# EAGLE design mediatek_basic_v10 (EAGLE 5.09)
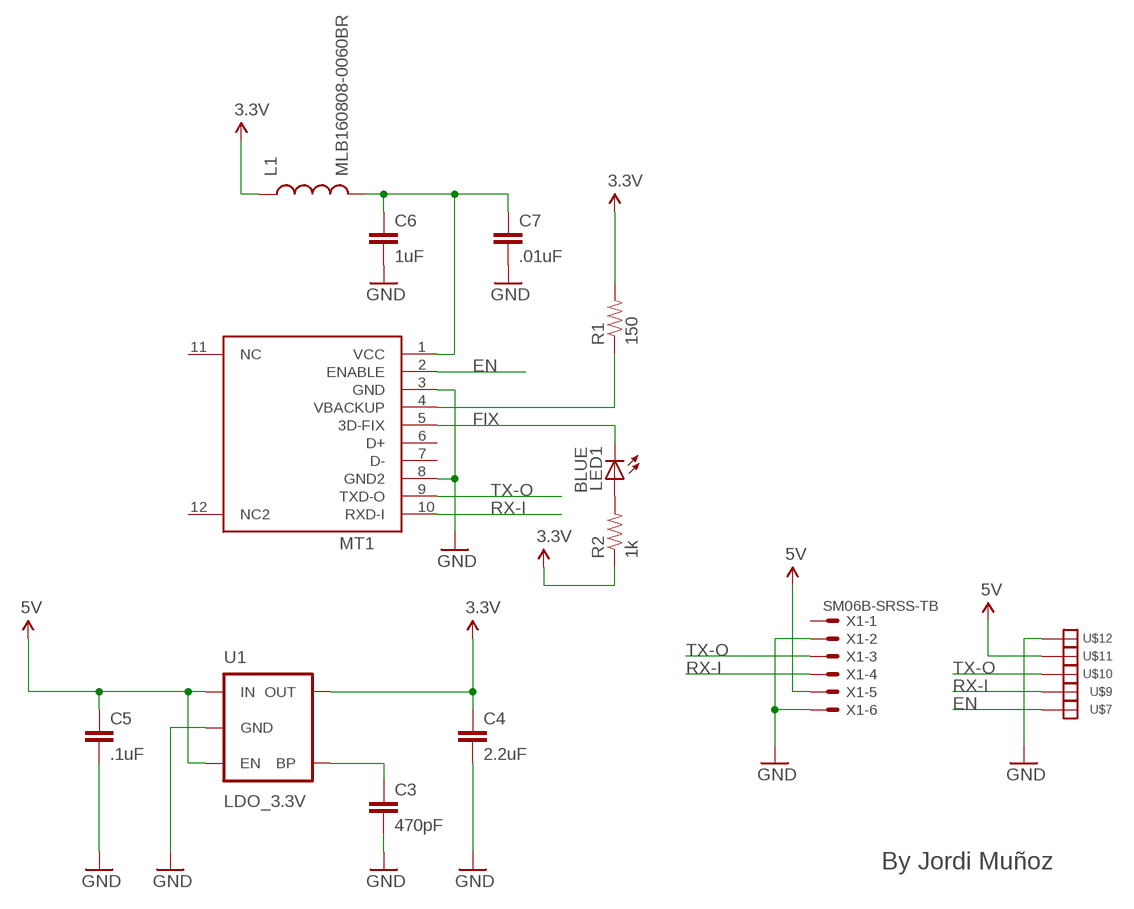
[diagram p0: schematic, sheet 1]

## Parts
C3  470pF  CAP0402  [C0402]
C4  2.2uF  CAP0402  [C0402]
C5  .1uF  CAP0402  [C0402]
C6  1uF  CAP0402  [C0402]
C7  .01uF  CAP0402  [C0402]
L1  MLB160808-0060BR  INDUCTOR0402  [C0402]
LED1  BLUE  LED0603  [LED-0603]
MT1  MEDIATEK_MT3329_PADS  [MEDIATEK_MT3329]
R1  150  RESISTOR0402  [C0402]
R2  1k  RESISTOR0402  [C0402]
U1  LDO_3.3V  V_REG_LDOSMD  [SOT23-5]
U$7  SOLDER_PAD150_75  [SOLD_PAD_150_75]
U$9  SOLDER_PAD150_75  [SOLD_PAD_150_75]
U$10  SOLDER_PAD150_75  [SOLD_PAD_150_75]
U$11  SOLDER_PAD150_75  [SOLD_PAD_150_75]
U$12  SOLDER_PAD150_75  [SOLD_PAD_150_75]
X1  SM06B-SRSS-TB  [SM06B-SRSS-TB]

## Nets
3.3V: C4.1 L1.1 R1.2 R2.1 U1.5(OUT)
5V: C5.1 U1.1(IN) U1.3(EN) U$11.P$1 X1.5
EN: MT1.2(ENABLE) U$7.P$1
FIX: LED1.C MT1.5(3D-FIX)
GND: C3.2 C4.2 C5.2 C6.2 C7.2 MT1.3(GND) MT1.8(GND2) U1.2(GND) U$12.P$1 X1.2 X1.6
N$2: MT1.4(VBACKUP) R1.1
N$4: C6.1 C7.1 L1.2 MT1.1(VCC)
N$5: C3.1 U1.4(BP)
N$6: LED1.A R2.2
RX-I: MT1.10(RXD-I) U$9.P$1 X1.4
TX-O: MT1.9(TXD-O) U$10.P$1 X1.3
Unconnected: MT1.6(D+) MT1.7(D-) MT1.11(NC) MT1.12(NC2) X1.1

## Notes on the sheet
- By Jordi Muñoz

## Library data of the parts
C3-C7 = DIYdrones3:CAP: Capacitor Standard 0603 ceramic capacitor, and 0.1" leaded capacitor.
L1 = SparkFun:INDUCTOR: Inductors Basic Inductor/Choke - 0603 and 1206. Footprints are not proven and vary greatly between part numbers.
LED1 = SparkFun:LED: LEDs Standard schematic elements and footprints for 5mm, 3mm, 1206, and 0603 sized LEDs. 5mm - Spark Fun Electronics SKU : COM-00529 (and others)
MT1 = DIYdrones_042910:MEDIATEK_MT3329_PADS: Based on MediaTek Single Chip Architecture. Dimension?16mm x 16mm x 6mm. L1 Frequency, C/A code, 66 channels. High Sensitivity?Up to -165dBm tracking, superior urban performances.
R1 R2 = DIYdrones3:RESISTOR: Resistor Basic schematic elements and footprints for 0603, 1206, and PTH 1/10th watt (small) resistors.
U1 = DIYdrones3:V_REG_LDO: Voltage Regulator LDO Standard 150mA LDO voltage regulator in SOT-23 layout. Micrel part MIC5205. BP (by-pass) pin is used to lower output noise with 470pF cap.
U$7 U$9-U$12 = DIYdrones2:SOLDER_PAD
X1 = con-jst2:?M06B-SRSS-TB: Disconnectable Crimp style connector, 1.0mm pitch 6 contacts

## Board
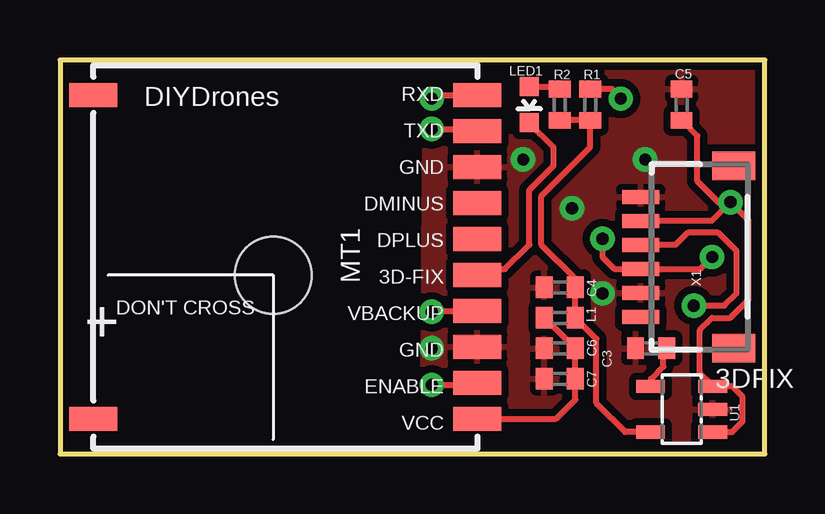
[diagram p1: board, top side]
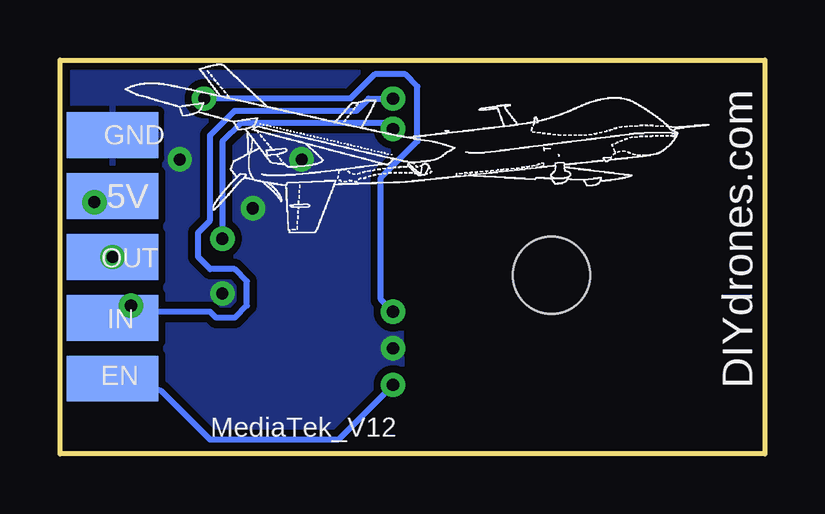
[diagram p2: board, bottom side, seen from below]

Size 29.37 x 16.43 mm. Coordinates in mm from the lower left corner, seen from the top.
Outline: 0,0 29.37,0 29.37,16.43 0,16.43 0,0
Copper layers (1*16): Top 0.035mm / dielectric 1.5mm / Bottom 0.035mm
Design rules "SparkFun": minimum track width 8mil, minimum drill 20mil, track to track 8mil, track to pad 8mil, pad to pad 8mil, via to via 8mil, smd to smd 8mil, copper to edge 10mil, drill to drill 8mil, minimum pad ring 12mil, minimum via ring 10mil, stop-mask expansion 4mil, vias tented up to drill 25mil, thermal gap 10mil
Holes 3.2 mm at 8.88,7.46

### Footprints (pad centres in the part's own frame; a part is rotated, then mirrored left to right if it is on the bottom)
C0402 = smd 0.7 x 0.9: 1 -0.65,0; 2 0.65,0
LED-0603 = smd 0.8 x 0.8: A 0,-0.75; C 0,0.75
MEDIATEK_MT3329 = smd 2 x 1: 1 -8,6.75; 2 -8,5.25; 3 -8,3.75; 4 -8,2.25; 5 -8,0.75; 6 -8,-0.75; 7 -8,-2.25; 8 -8,-3.75; 9 -8,-5.25; 10 -8,-6.75; 11 8,6.75; 12 8,-6.75
SOT23-5 = smd 0.55 x 1.2: 1 -0.95,-1.3; 2 0,-1.3; 3 0.95,-1.3; 4 0.95,1.3; 5 -0.95,1.3
SOLD_PAD_150_75 = smd 3.81 x 1.905: P$1 0,0
SM06B-SRSS-TB = smd 0.6 x 1.55: 1 -2.5,2.975; 2 -1.5,2.975; 3 -0.5,2.975; 4 0.5,2.975; 5 1.5,2.975; 6 2.5,2.975 | smd 1.2 x 1.8: FIT@1 -3.8,-0.9; FIT@2 3.8,-0.9

### Placement (x,y rotation side)
C3  24.63,4.41 180 top
C4  20.82,6.95 180 top
C5  25.9,14.57 90 top
C6  20.82,4.41 180 top
C7  20.82,3.14 180 top
L1  20.82,5.68 180 top
LED1  19.55,14.57 180 top
MT1  9.39,8.22 180 top
R1  22.09,14.57 270 top
R2  20.82,14.57 90 top
U1  25.9,1.87 90 top
U$5  [UAV_LOGO_SMALL_2]  13.46,12.28 0 bottom
U$7  27.17,3.14 0 bottom
U$9  27.17,5.68 0 bottom
U$10  27.17,8.22 0 bottom
U$11  27.17,10.76 0 bottom
U$12  27.17,13.3 180 bottom
X1  27.17,8.22 90 top

### Tracks (layer width: path | path; a pad name or v marks a point on that pad's centre or on a via)
3.3V
  Top 0.254: U1.5 23.55,0.92 22.35,2.12 22.35,4.8 L1.1 C4.1 21.47,7.31 20.06,8.72 20.06,10.76 22.09,12.79 R1.2 R2.1
5V  (via drill 0.51)
  Top 0.254: 27.14,0.85 U1.1 28,0.92 28.44,1.36 28.44,2.38 28,2.82 U1.3 27.17,2.85 27.17,2.88 26.66,3.39 26.66,5.17 27.17,5.68 27.94,5.68 28.7,6.44 28.7,9.74 v27.94,10.5 | X1.5 27.15,9.72 v27.94,10.5 | v27.94,10.5 27.43,10.5 26.55,11.38 26.55,13.27 C5.1
  Bottom 0.254: v27.94,10.5 U$11.P$1
EN  (via drill 0.51)
  Top 0.254: v15.49,2.88 17.31,2.88 MT1.2
  Bottom 0.254: v15.49,2.88 17.78,0.6 23.11,0.6 25.14,2.63 U$7.P$1
FIX
  Top 0.254: LED1.C 19.55,13.8 20.57,12.79 20.57,12.03 19.55,11.01 19.55,8.72 18.54,7.71 17.64,7.71 MT1.5
GND  (via drill 0.51)
  other vias: 15.49,4.41 24.38,12.28 19.3,12.28 22.6,6.69 21.33,10.25
  pour Top (isolate 0.305): 15.23,16.34 29.71,16.34 29.59,-0.04 15.11,-0.04
  pour Bottom (isolate 0.305): 15.23,16.34 29.71,16.34 29.59,-0.04 15.11,-0.04
N$2  (via drill 0.51)
  Top 0.254: MT1.4 15.53,5.97 v15.49,5.93 | R1.1 23,15.22 v23.36,14.82
  Bottom 0.254: v23.36,14.82 17.27,14.82 16.25,15.84 14.98,15.84 14.47,15.33 14.47,13.04 16,11.52 16,6.44 v15.49,5.93
N$4
  Top 0.254: L1.2 20.2,5.68 C6.1 C7.1 21.47,2.26 20.68,1.47 MT1.1
N$5
  Top 0.254: U1.4 24.63,2.85 24.63,3.14 25.14,3.64 25.14,4.26 C3.1
N$6
  Top 0.254: LED1.A 20.72,15.32 R2.2
RX-I  (via drill 0.51)
  Top 0.254: v15.49,14.82 15.64,14.97 MT1.10 | X1.4 25.64,8.72 26.16,9.23 27.43,9.23 28.19,8.47 28.19,6.69 27.68,6.18 v26.41,6.18
  Bottom 0.254: v15.49,14.82 16.5,14.82 17.01,14.31 22.09,14.31 23.11,13.3 23.11,9.74 23.62,9.23 23.62,8.22 23.11,7.71 22.09,7.71 21.59,7.2 21.59,6.18 22.09,5.68 22.86,5.68 23.11,5.93 26.92,5.93 U$9.P$1 26.92,5.68 v26.41,6.18
TX-O  (via drill 0.51)
  Top 0.254: MT1.9 17.31,13.55 v15.49,13.55 | U$10.P$1 26.67,7.72 X1.3 23.1,7.72 22.6,8.22 v22.6,8.98
  Bottom 0.254: v15.49,13.55 15.74,13.8 21.84,13.8 22.6,13.04 v22.6,8.98
  other vias: 27.17,8.22

### Text on the board
tPlace: 3DFIX
bPlace: DIYdrones.com | GND | 5V | OUT | IN | EN | MediaTek_V12
tNames: +